# Altium schematic sheet GNSS modulis.SchDoc
size B; SheetNumber: 1; SheetTotal: 6
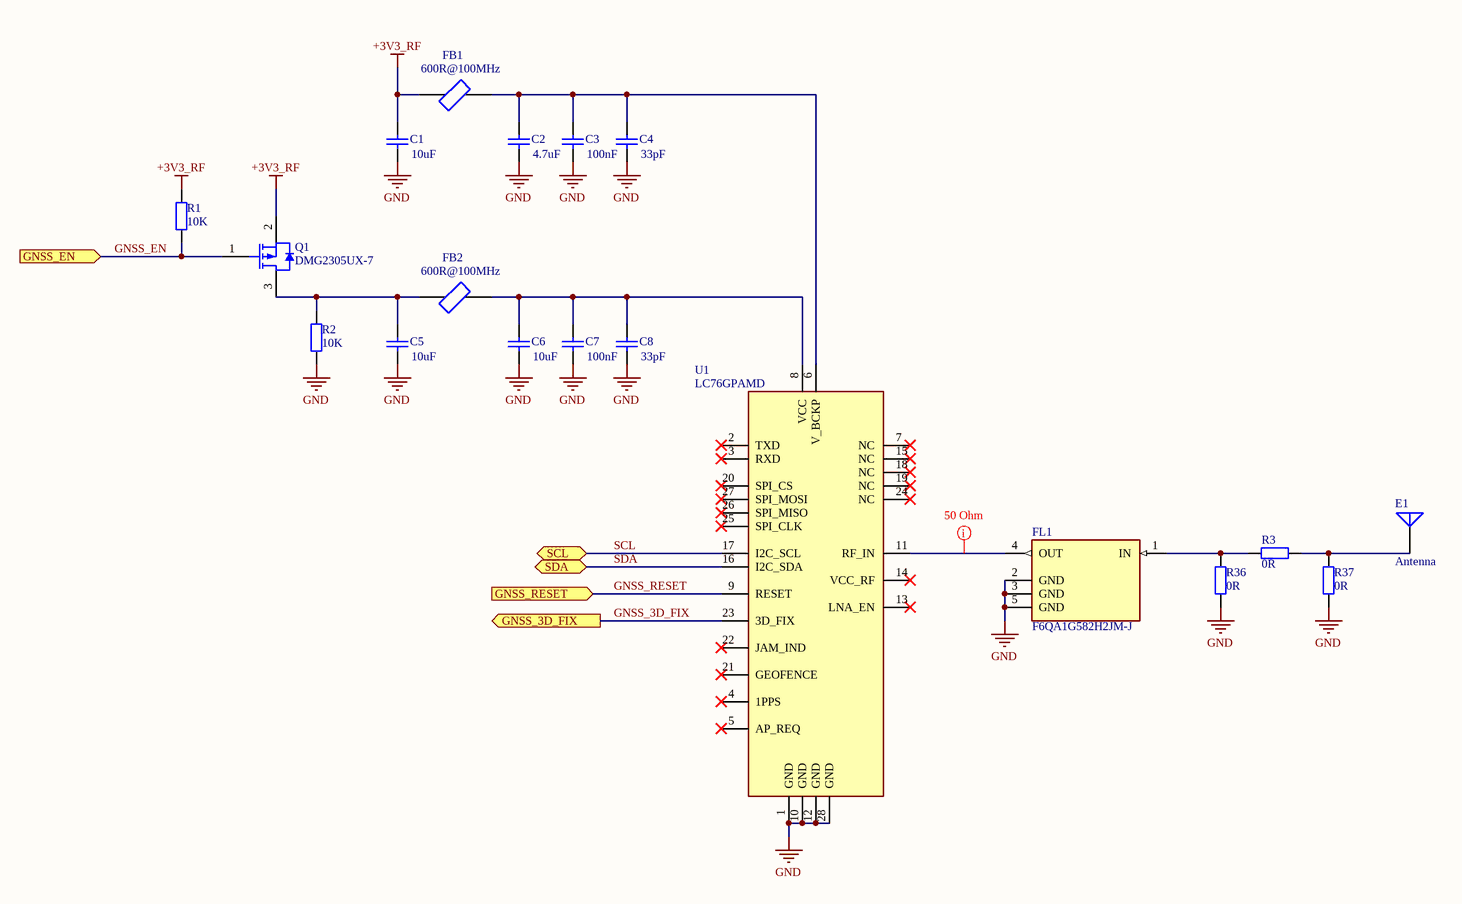
[diagram p0: GNSS modulis.SchDoc]

## Parts
C1  10uF  [0402]
C2  4.7uF  [0402]
C3  100nF  [0402]
C4  33pF  [0402]
C5  10uF  [0402]
C6  10uF  [0402]
C7  100nF  [0402]
C8  33pF  [0402]
E1  Antenna  [204286-0001_MOL]
FB1  600R@100MHz  [0402 Ferrite Bead]
FB2  600R@100MHz  [0402 Ferrite Bead]
FL1  F6QA1G582H2JM-J  [FIL_F6QA1G582H2JM-J]
Q1  DMG2305UX-7  [JSCJ-SOT23-3_V]
R1  10K  [SMD-0402-RES]
R2  10K  [SMD-0402-RES]
R3  0R  [SMD-0402-RES]
R36  0R  [SMD-0402-RES]
R37  0R  [SMD-0402-RES]
U1  LC76GPAMD  [LC76GPAMD]

## Ports
GNSS_3D_FIX (out, see MCU[3B]), GNSS_EN (in, see MCU[3B]), GNSS_RESET (in, see MCU[3B]), SCL (bidir, see Battery charger[1B], MCU[1C]), SDA (bidir, see Battery charger[1B], MCU[1C])

## Nets
+3V3_RF: C1.2 FB1.1 Q1.2(SOURCE) R1.2
GND: C1.1 C2.1 C3.1 C4.1 C5.1 C6.1 C7.1 C8.1 FL1.2(GND) FL1.3(GND) FL1.5(GND) R2.1 R36.1 R37.1 U1.1(GND) U1.10(GND) U1.12(GND) U1.28(GND)
GNSS_3D_FIX: U1.23(3D_FIX) ; port GNSS_3D_FIX
GNSS_EN: Q1.1(GATE) R1.1 ; port GNSS_EN
GNSS_RESET: U1.9(RESET) ; port GNSS_RESET
SCL: U1.17(I2C_SCL) ; port SCL
SDA: U1.16(I2C_SDA) ; port SDA
NetC2_2: C2.2 C3.2 C4.2 FB1.2 U1.6(V_BCKP)
NetC5_2: C5.2 FB2.1 Q1.3(DRAIN) R2.2
NetC6_2: C6.2 C7.2 C8.2 FB2.2 U1.8(VCC)
NetE1_1: E1.1(A) R3.2 R37.2
NetFL1_1: FL1.1(IN) R3.1 R36.2
NetFL1_4: FL1.4(OUT) U1.11(RF_IN)

Not connected (* = marked no-connect by the designer): U1 2(TXD)* 3(RXD)* 4(1PPS)* 5(AP_REQ)* 7(NC)* 13(LNA_EN)* 14(VCC_RF)* 15(NC)* 18(NC)* 19(NC)* 20(SPI_CS)* 21(GEOFENCE)* 22(JAM_IND)* 24(NC)* 25(SPI_CLK)* 26(SPI_MISO)* 27(SPI_MOSI)*

## Layout directives
mark named 50 Ohm: NetFL1_4

## Library data of the parts
C1-C8 = Cap: Capacitor; Published: 8-Jun-2000; LatestRevisionDate: 17-Jul-2002; LatestRevisionNote: Re-released for DXP Platform.; PackageReference: RAD-0.3; Publisher: Altium Limited; PackageDescription: Radial Cap, Thru-Hole; 2 Leads; 0.3 in Pin Spacing
E1 = Antenna: Generic Antenna; Published: 24-Mar-1999; LatestRevisionDate: 17-Jul-2002; LatestRevisionNote: Re-released for DXP Platform.; PackageReference: PIN1; Publisher: Altium Limited
FB1 FB2 = Ferrite: Ferrite Beads FERRITE BEAD 600 OHM 0603 1LN; MF: Laird-Signal Integrity Products; MP: MI0805K400R-10; SnapEDA_Link: https://www.snapeda.com/parts/MI0805K400R-10/Laird-Signal+Integrity+Products/view-part/?ref=snap; Package: 0805 Laird; Value: *; Check_prices: https://www.snapeda.com/parts/MI0805K400R-10/Laird-Signal+Integrity+Products/view-part/?ref=eda
FL1 = F6QA1G582H2JM-J: 1.582GHz Frequency GPS RF SAW Filter (Surface Acoustic Wave) 1.8dB  Bandwidth 5-SMD, No Lead; MF: Taiyo Yuden; SnapEDA_Link: https://www.snapeda.com/parts/F6QA1G582H2JM-J/Taiyo+Yuden/view-part/?ref=snap; Package: SMD-5 Taiyo Yuden; Value: *; MP: F6QA1G582H2JM-J; Check_prices: https://www.snapeda.com/parts/F6QA1G582H2JM-J/Taiyo+Yuden/view-part/?ref=eda
Q1 = CMP-013-00015-3: P-Channel Plastic Encapsulate MOSFET, 12 V, 4.1 A, 3-Pin SOT23, Tape and Reel; Manufacturer: Jiangsu Changjiang Electronics Technology; Package Version: Rev. E, 09/2009; Datasheet URL: http://www.cj-elec.com/gallery/txUpfile/5140ba9ed47d18467ea4bddc055cd747.pdf; Case/Package: SOT23-3; Mounting Technology: SM; RoHS Compliant: Unknown; Datasheet Version: Rev. F, 04/2015; Package Description: 3-Pin Small Outline Transistor, Body 2.9 x 1.3 mm, Pitch 0.95 mm; Package Reference: SOT23-3
R1-R3 R36 R37 = Res2: Resistor; Published: 8-Jun-2000; LatestRevisionDate: 17-Jul-2002; LatestRevisionNote: Re-released for DXP Platform.; PackageReference: AXIAL-0.4; Publisher: Altium Limited; PackageDescription: Axial Device, Thru-Hole; 2 Leads; 0.4 in Pin Spacing
  R1 R2: Value: 10K
  R3 R36 R37: Value: 0R
U1 = LC76GPAMD: Manufacturer_Name: Quectel; Datasheet Link: https://www.mouser.es/pdfDocs/L76_and_LC76_series_Hardware_Comparison_V1020220515.pdf; Height: 2.7mm; Manufacturer_Part_Number: LC76GPAMD; Mouser Part Number: 277-LC76GPAMD; Mouser Price/Stock: https://www.mouser.co.uk/ProductDetail/Quectel/LC76GPAMD?qs=vvQtp7zwQdMfDuCTmjRUww%3D%3D; Arrow Part Number: LC76GPAMD; Arrow Price/Stock: https://www.arrow.com/en/products/lc76gpamd/quectel-wireless-solutions-co-ltd?utm_currency=USD&region=nac